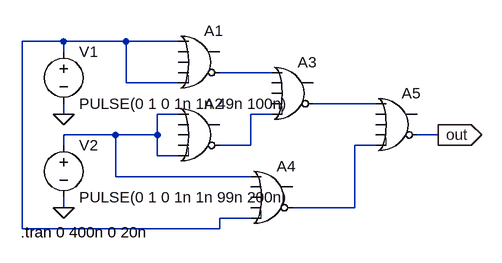
[diagram p0: schematic XOR using OR.asc]
XOR using OR.asc, the LTspice schematic file:
Version 4
SHEET 1 880 680
WIRE -112 32 -176 32
WIRE -16 32 -112 32
WIRE 64 32 -16 32
WIRE -112 48 -112 32
WIRE 208 80 128 80
WIRE -16 96 -16 32
WIRE 64 96 -16 96
WIRE 368 128 272 128
WIRE -112 144 -112 128
WIRE 64 144 32 144
WIRE 208 144 176 144
WIRE -32 176 -112 176
WIRE 32 176 32 144
WIRE 32 176 -32 176
WIRE 464 176 432 176
WIRE -112 192 -112 176
WIRE 176 192 176 144
WIRE 176 192 128 192
WIRE 368 192 336 192
WIRE 32 208 32 176
WIRE 64 208 32 208
WIRE -32 240 -32 176
WIRE 176 240 -32 240
WIRE -112 288 -112 272
WIRE 336 288 336 192
WIRE 336 288 240 288
WIRE 176 304 128 304
WIRE -176 320 -176 32
WIRE 128 320 128 304
WIRE 128 320 -176 320
FLAG -112 144 0
FLAG -112 288 0
FLAG 464 176 out
IOPIN 464 176 Out
SYMBOL voltage -112 32 R0
WINDOW 123 0 0 Left 0
WINDOW 39 0 0 Left 0
SYMATTR InstName V1
SYMATTR Value PULSE(0 1 0 1n 1n 49n 100n)
SYMBOL voltage -112 176 R0
WINDOW 123 0 0 Left 0
WINDOW 39 0 0 Left 0
SYMATTR InstName V2
SYMATTR Value PULSE(0 1 0 1n 1n 99n 200n)
SYMBOL Digital\\or 96 0 R0
SYMATTR InstName A1
SYMBOL Digital\\or 96 112 R0
SYMATTR InstName A2
SYMBOL Digital\\or 240 48 R0
SYMATTR InstName A3
SYMBOL Digital\\or 208 208 R0
SYMATTR InstName A4
SYMBOL Digital\\or 400 96 R0
SYMATTR InstName A5
TEXT -178 326 Left 2 !.tran 0 400n 0 20n

The netlist it stands for:
* XOR using OR.asc
V1 N001 0 PULSE(0 1 0 1n 1n 49n 100n)
V2 N004 0 PULSE(0 1 0 1n 1n 99n 200n)
A1 N001 0 0 0 N001 N002 0 0 OR
A2 N004 0 0 0 N004 N005 0 0 OR
A3 N002 0 0 0 N005 N003 0 0 OR
A4 N004 0 0 0 N001 N006 0 0 OR
A5 N003 0 0 0 N006 out 0 0 OR
.tran 0 400n 0 20n
.backanno
.end